# EAGLE design routev7.5 (EAGLE 8.6.0)

## Sheet 1 of 2
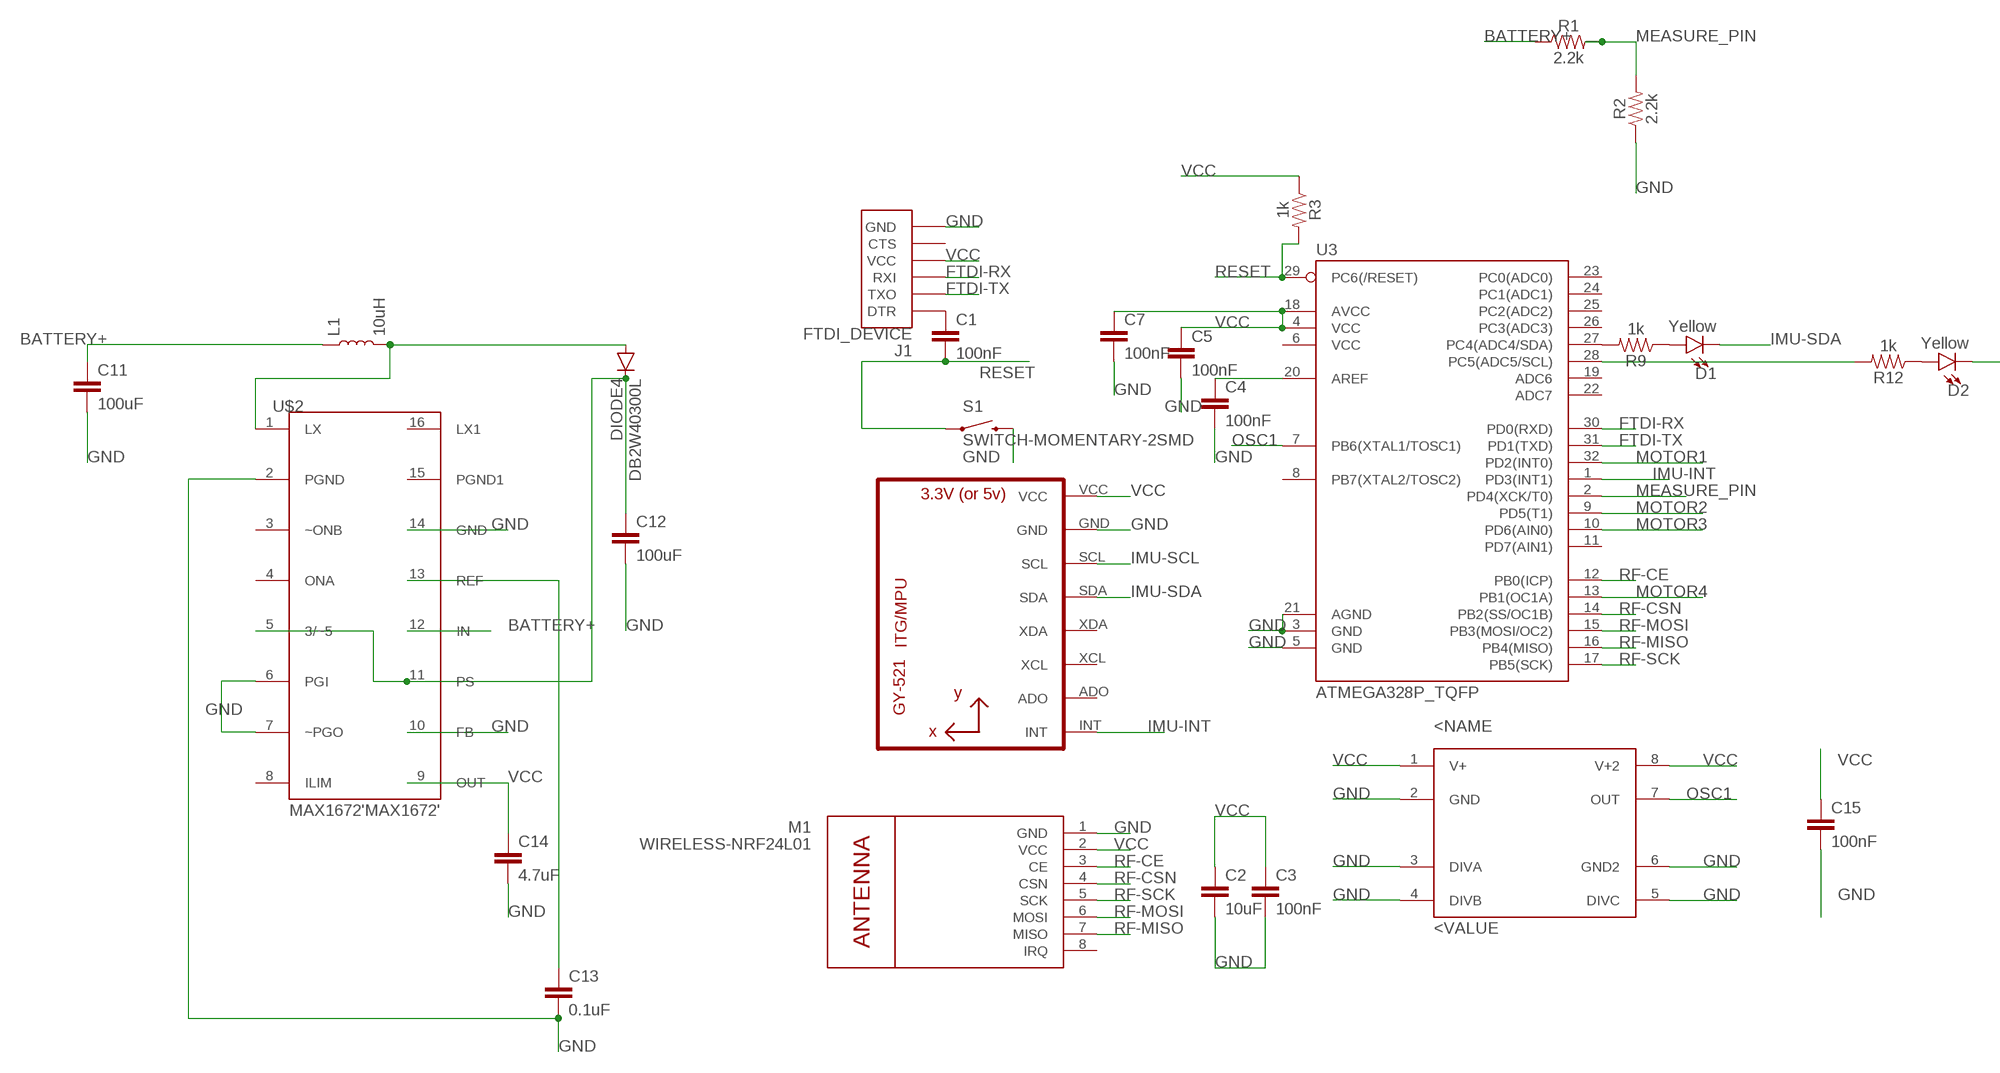
[diagram p0: schematic, sheet 1, part 1 of 2]
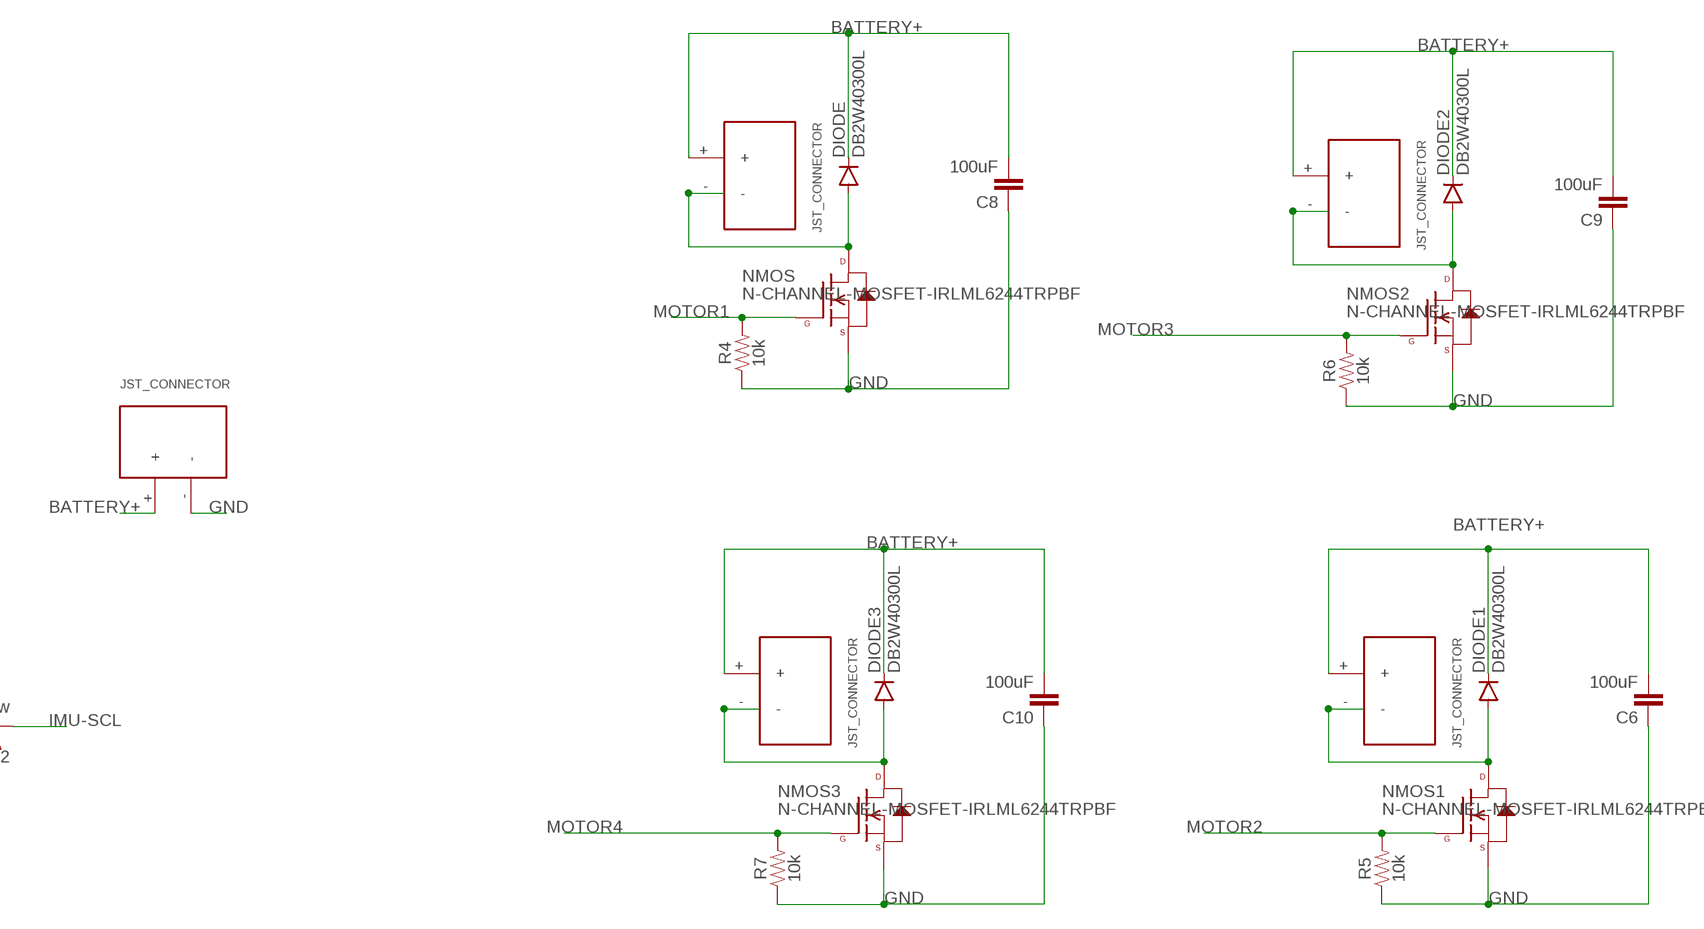
[diagram p1: schematic, sheet 1, part 2 of 2]

### Parts
C1  100nF  CAP0603-CAP  [0603-CAP]
C2  10uF  CAP0603-CAP  [0603-CAP]
C3  100nF  CAP0603-CAP  [0603-CAP]
C4  100nF  CAP0603-CAP  [0603-CAP]
C5  100nF  CAP0603-CAP  [0603-CAP]
C6  100uF  CAP0603-CAP  [0603-CAP]
C7  100nF  CAP0603-CAP  [0603-CAP]
C8  100uF  CAP0603-CAP  [0603-CAP]
C9  100uF  CAP0603-CAP  [0603-CAP]
C10  100uF  CAP0603-CAP  [0603-CAP]
C11  100uF  CAP0603-CAP  [0603-CAP]
C12  100uF  CAP0603-CAP  [0603-CAP]
C13  0.1uF  CAP0603-CAP  [0603-CAP]
C14  4.7uF  CAP0603-CAP  [0603-CAP]
C15  100nF  0.1UF-25V(+80/-20%)(0603)  [0603-CAP]
D1  Yellow  LED-YELLOWLILYPAD  [LED-1206]
D2  Yellow  LED-YELLOWLILYPAD  [LED-1206]
DIODE  DB2W40300L  [MINI2-F3-B]
DIODE1  DB2W40300L  [MINI2-F3-B]
DIODE2  DB2W40300L  [MINI2-F3-B]
DIODE3  DB2W40300L  [MINI2-F3-B]
DIODE4  DB2W40300L  [MINI2-F3-B]
J1  FTDI_DEVICE  [FTDI_DEVICE_SIDE]
L1  10uH  INDUCTOR-0603-33NH  [0603]
M1  WIRELESS-NRF24L01  [WIRELESS-NRF24L01]
MOTOR  JST_CONNECTOR_FEMALE  [JST_CONNECTOR_FEMALE]
MOTOR1  JST_CONNECTOR_FEMALE  [JST_CONNECTOR_FEMALE]
MOTOR2  JST_CONNECTOR_FEMALE  [JST_CONNECTOR_FEMALE]
MOTOR3  JST_CONNECTOR_FEMALE  [JST_CONNECTOR_FEMALE]
NMOS  N-CHANNEL-MOSFET-IRLML6244TRPBF  [SOT23-3]
NMOS1  N-CHANNEL-MOSFET-IRLML6244TRPBF  [SOT23-3]
NMOS2  N-CHANNEL-MOSFET-IRLML6244TRPBF  [SOT23-3]
NMOS3  N-CHANNEL-MOSFET-IRLML6244TRPBF  [SOT23-3]
R1  2.2k  2.2KOHM-0603-1/10W-1%  [0603]
R2  2.2k  2.2KOHM-0603-1/10W-1%  [0603]
R3  1k  2.2KOHM-0603-1/10W-1%  [0603]
R4  10k  2.2KOHM-0603-1/10W-1%  [0603]
R5  10k  2.2KOHM-0603-1/10W-1%  [0603]
R6  10k  2.2KOHM-0603-1/10W-1%  [0603]
R7  10k  2.2KOHM-0603-1/10W-1%  [0603]
R9  1k  2.2KOHM-0603-1/10W-1%  [0603]
R12  1k  2.2KOHM-0603-1/10W-1%  [0603]
S1  SWITCH-MOMENTARY-2SMD  [TACTILE-SWITCH-SMD]
U2  GY-521MPU6050  [GY-521]
U3  ATMEGA328P_TQFP  [TQFP32-08]
U$1  JST_CONNECTOR_FEMALE  [JST_CONNECTOR_FEMALE]
U$2  MAX1672'MAX1672'  [21-0055H_16]
U$3  LTC6930CMS8-8.19LTC6930CMS8-8.19  [SOP65P490X110-8N]

### Nets
BATTERY+: C6.2 C8.2 C9.2 C10.2 C11.1 DIODE1.NEG(GPIN) DIODE2.NEG(GPIN) DIODE3.NEG(GPIN) DIODE.NEG(GPIN) L1.1 MOTOR1.+ MOTOR2.+ MOTOR3.+ MOTOR.+ R1.1 U$1.+ U$2.12(IN)
FTDI-RX: J1.P$3(RXI) U3.30(PD0(RXD))
FTDI-TX: J1.P$2(TXO) U3.31(PD1(TXD))
GND: C2.2 C3.2 C4.2 C5.2 C6.1 C7.2 C8.1 C9.1 C10.1 C11.2 C12.2 C13.2 C14.2 C15.2 J1.P$6(GND) M1.1(GND) NMOS1.2(S) NMOS2.2(S) NMOS3.2(S) NMOS.2(S) R2.1 R4.1 R5.1 R6.1 R7.1 S1.3 U2.GND U3.3(GND) U3.5(GND) U3.21(AGND) U$1.- U$2.2(PGND) U$2.6(PGI) U$2.7(~PGO) U$2.10(FB) U$2.14(GND) U$3.2(GND) U$3.3(DIVA) U$3.4(DIVB) U$3.5(DIVC) U$3.6(GND2)
IMU-INT: U2.INT U3.1(PD3(INT1))
IMU-SCL: D2.C U2.SCL
IMU-SDA: D1.C U2.SDA
MEASURE_PIN: R1.2 R2.2 U3.2(PD4(XCK/T0))
MOTOR1: NMOS.1(G) R4.2 U3.32(PD2(INT0))
MOTOR2: NMOS1.1(G) R5.2 U3.9(PD5(T1))
MOTOR3: NMOS2.1(G) R6.2 U3.10(PD6(AIN0))
MOTOR4: NMOS3.1(G) R7.2 U3.13(PB1(OC1A))
N$1: DIODE4.POS(PPIN) L1.2 U$2.1(LX)
N$2: C4.1 U3.20(AREF)
N$3: D1.A R9.1
N$4: DIODE1.POS(PPIN) MOTOR1.- NMOS1.3(D)
N$5: DIODE2.POS(PPIN) MOTOR2.- NMOS2.3(D)
N$6: DIODE.POS(PPIN) MOTOR.- NMOS.3(D)
N$7: DIODE3.POS(PPIN) MOTOR3.- NMOS3.3(D)
N$8: R9.2 U3.27(PC4(ADC4/SDA))
N$9: D2.A R12.1
N$10: R12.2 U3.28(PC5(ADC5/SCL))
N$13: C1.1 J1.P$1(DTR)
OSC1: U3.7(PB6(XTAL1/TOSC1)) U$3.7(OUT)
RESET: C1.2 R3.2 S1.1 U3.29(PC6(/RESET))
RF-CE: M1.3(CE) U3.12(PB0(ICP))
RF-CSN: M1.4(CSN) U3.14(PB2(SS/OC1B))
RF-MISO: M1.7(MISO) U3.16(PB4(MISO))
RF-MOSI: M1.6(MOSI) U3.15(PB3(MOSI/OC2))
RF-SCK: M1.5(SCK) U3.17(PB5(SCK))
VCC: C2.1 C3.1 C5.1 C7.1 C14.1 C15.1 J1.P$4(VCC) M1.2(VCC) R3.1 U2.VCC U3.4(VCC) U3.18(AVCC) U$2.9(OUT) U$3.1(V+) U$3.8(V+2)
VR-PS: C12.1 DIODE4.NEG(GPIN) U$2.5(3/~5) U$2.11(PS)
VR-REF: C13.1 U$2.13(REF)
Unconnected: J1.P$5(CTS) M1.8(IRQ) U2.ADO U2.XCL U2.XDA U3.6(VCC) U3.8(PB7(XTAL2/TOSC2)) U3.11(PD7(AIN1)) U3.19(ADC6) U3.22(ADC7) U3.23(PC0(ADC0)) U3.24(PC1(ADC1)) U3.25(PC2(ADC2)) U3.26(PC3(ADC3)) U$2.3(~ONB) U$2.4(ONA) U$2.8(ILIM) U$2.15(PGND1) U$2.16(LX1)

## Sheet 2 of 2

## Library data of the parts
C1-C14 = SparkFun-Passives:CAP: Capacitor Standard 0603 ceramic capacitor, and 0.1" leaded capacitor.
C15 = SparkFun-Capacitors:0.1UF-25V(+80/-20%)(0603): CAP-00810 Ceramic Standard decoupling cap; PROD_ID: CAP-00810; VALUE: 0.1uF
D1 D2 = SparkFun-LED:LED-YELLOW: Yellow SMD LED Used in manufacturing several products at SparkFun. Packages: 0603 - SMD 0603 package[Product Link] <http://www.kingbrightusa.com/product.asp?catalog_name=LED&product_id=APT1608SYCK> 0603 -SMART - SMART SMD 0603 package (more efficient/more expensive) [Product Link] <http://www.osram-os.com/osram_os/en/products/product-catalog/led-light-emitting-diodes/smartled-0603/ly-l29k/index.jsp> LilyPad - SMD1206 package[Product Datasheet] <https://www.sparkfun.com/datasheets/DevTools/LilyPad/Q150YUS4.pdf> SparkFun Products: Blynk Board <https://www.sparkfun.com/products/13794> IOIO-OTG <https://www.sparkfun.com/products/13613> XBee Explorer Serial <https://www.sparkfun.com/products/13225>; PROD_ID: DIO-09909
DIODE DIODE1-DIODE4 = quad:DB2W40300L
J1 = quad:FTDI_DEVICE: Connector which mates to FTDI basic or FTDI cable.
L1 = SparkFun-Coils:INDUCTOR: Inductors Resist changes in electrical current. Basically a coil of wire. SparkFun Products: SparkFun Load Cell Amplifier - HX711 <https://www.sparkfun.com/products/13879> IOIO-OTG - V2.2 <https://www.sparkfun.com/products/13613>; PROD_ID: NDUC-07874; VALUE: 33nH/±5%/500mA
M1 = quad:WIRELESS-NRF24L01: 2.4 GHz Wireless Module based on NRF24L01 chip
MOTOR MOTOR1-MOTOR3 U$1 = quad:JST_CONNECTOR_FEMALE
NMOS NMOS1-NMOS3 = quad:N-CHANNEL-MOSFET: N-Channel MOSFET Mode Field Effect Transistor; DATASHEET: http://www.mouser.com/ds/2/196/irlml6244pbf-936666.pdf; MOUSER: 942-IRLML6244TRPBF; URL: http://www.mouser.com/Search/ProductDetail.aspx?R=IRLML6244TRPBFvirtualkey57370000virtualkey942-IRLML6244TRPBF
R1 R2 = SparkFun-Resistors:2.2KOHM: 2.2kΩ resistor A resistor is a passive two-terminal electrical component that implements electrical resistance as a circuit element. Resistors act to reduce current flow, and, at the same time, act to lower voltage levels within circuits. - Wikipedia; PROD_ID: RES-08272
R3-R7 R9 R12 = SparkFun-Resistors:2.2KOHM: 2.2kΩ resistor A resistor is a passive two-terminal electrical component that implements electrical resistance as a circuit element. Resistors act to reduce current flow, and, at the same time, act to lower voltage levels within circuits. - Wikipedia; PROD_ID: RES-08272; VALUE: 2.2k
S1 = quad:SWITCH-MOMENTARY-2: Various NO switches- pushbuttons, reed, etc; PROD_ID: SWCH-08247
U2 = quad:GY-521
U3 = quad:ATMEGA328P_TQFP; PROD_ID: IC-09069
U$2 = voltreg:MAX1672
U$3 = LTC6390:LTC6930CMS8-8.19

## Board
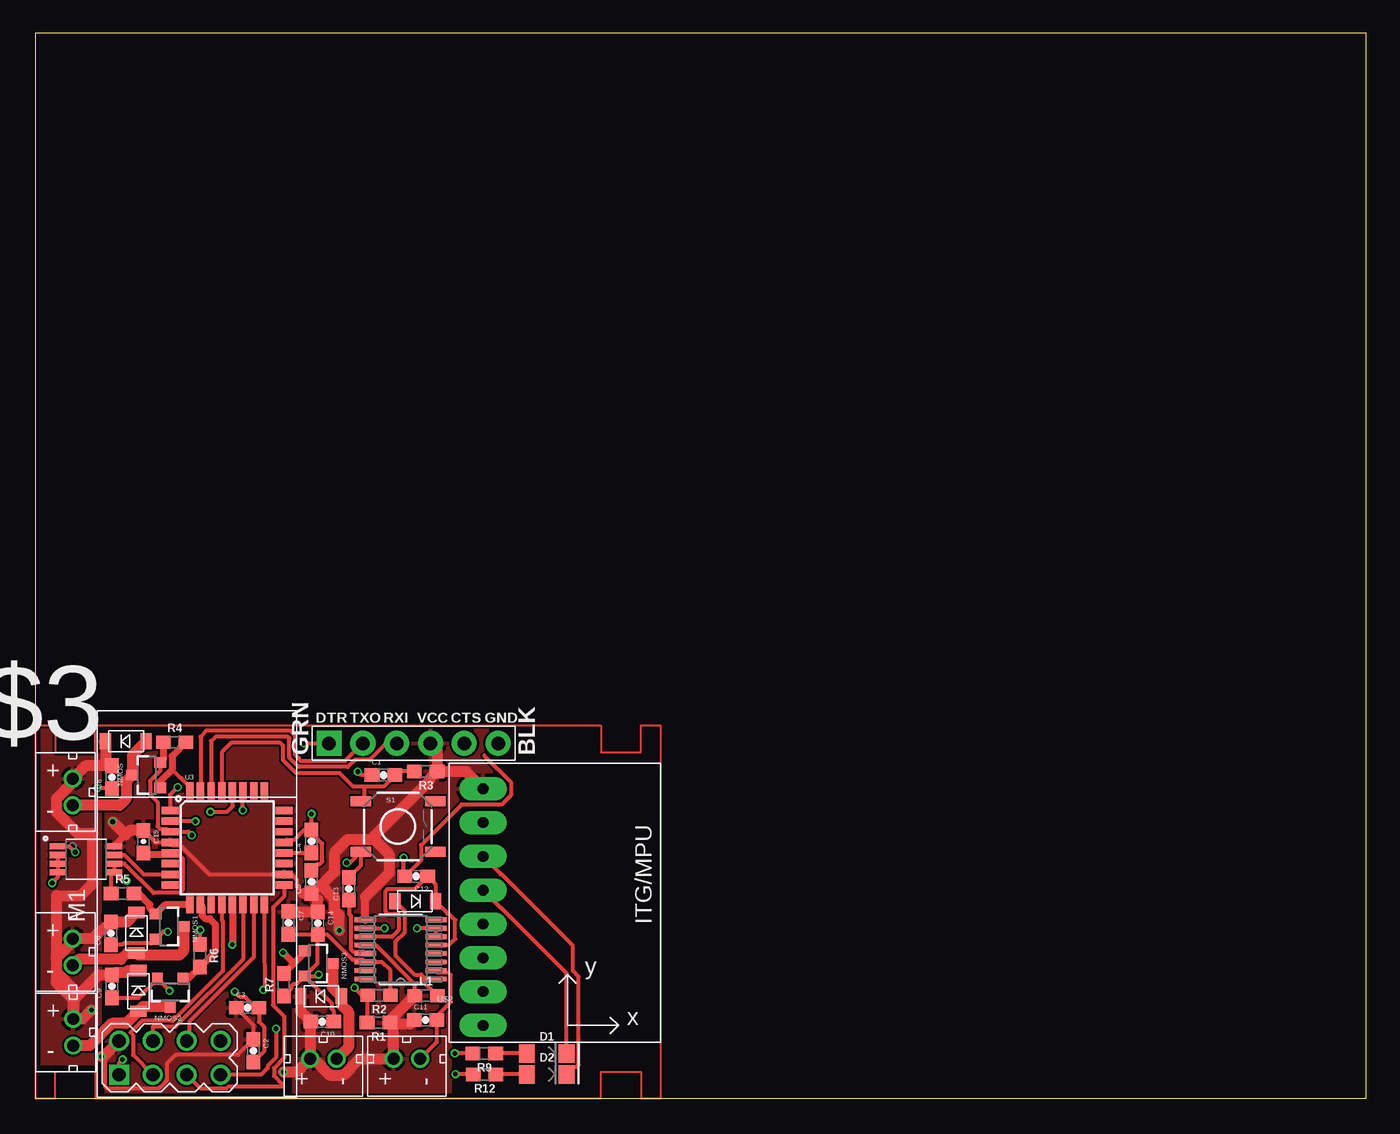
[diagram p2: board, top side]
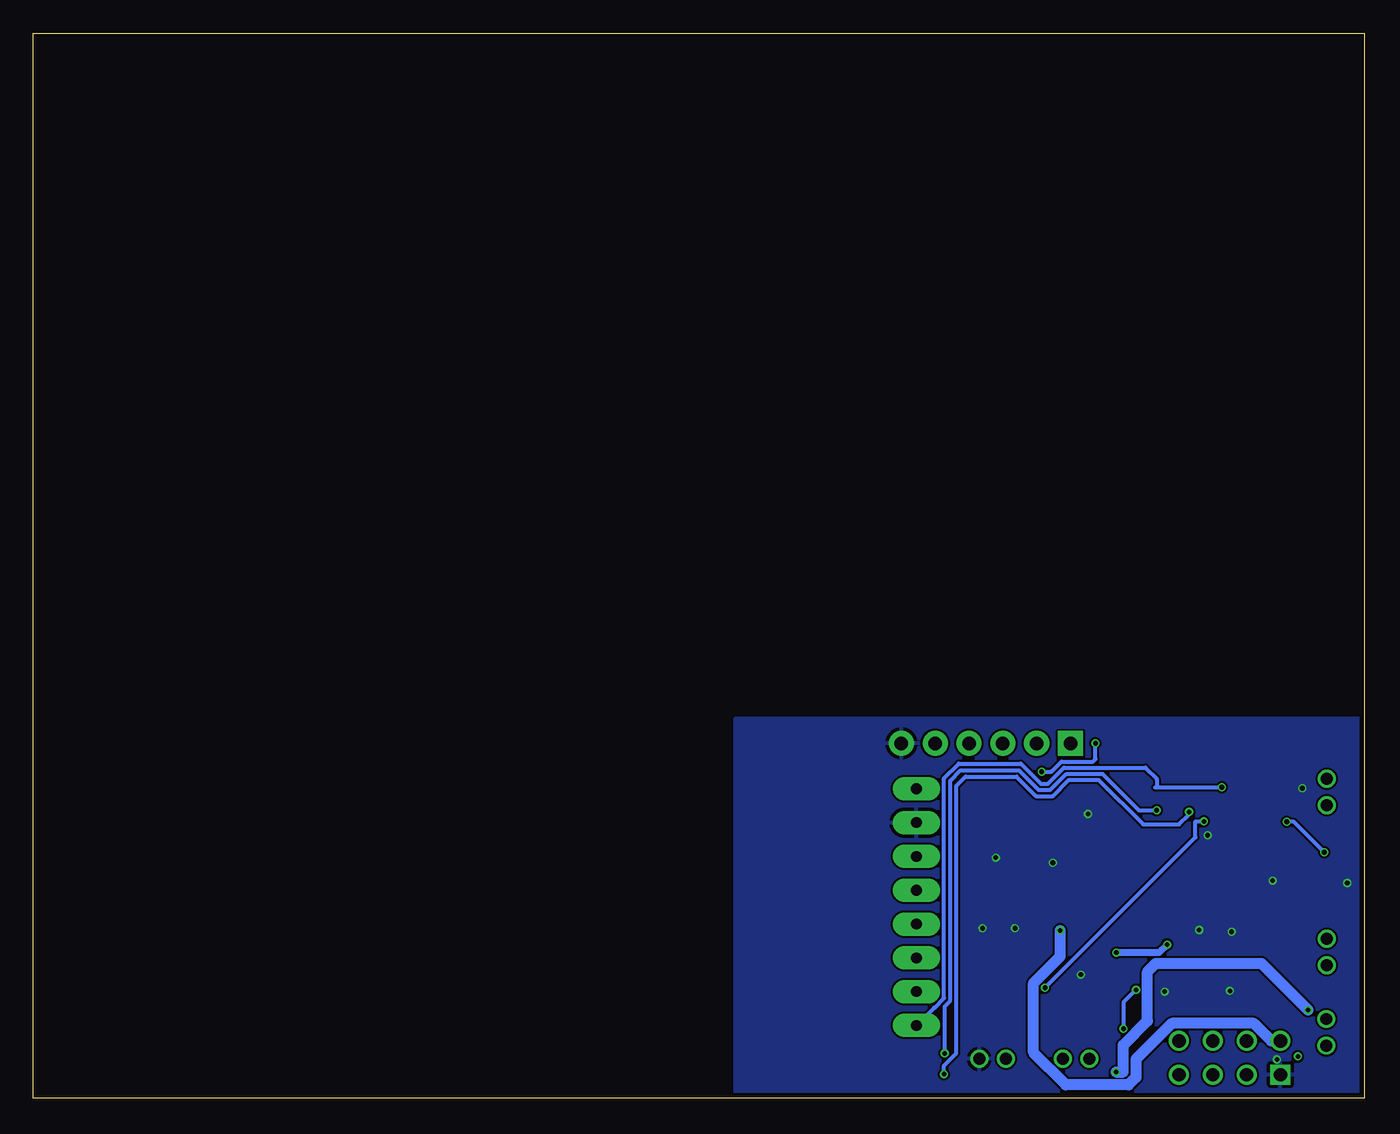
[diagram p3: board, bottom side, seen from below]

Size 100 x 80 mm. Coordinates in mm from the lower left corner, seen from the top.
Outline: 0,0 100,0 100,80 0,80 0,0
Copper layers (1*16): Top 0.035559375mm / dielectric 1.6mm / Bottom 0.035559375mm
Design rules "oshpark-2layer": minimum track width 6mil, minimum drill 10mil, track to track 6mil, track to pad 6mil, pad to pad 6mil, via to via 6mil, smd to smd 6mil, copper to edge 15mil, drill to drill 6mil, minimum pad ring 5mil, minimum via ring 5mil, stop-mask expansion 2.5mil, vias tented up to drill 0mil, thermal gap 10mil

### Footprints (pad centres in the part's own frame; a part is rotated, then mirrored left to right if it is on the bottom)
0603-CAP = smd 1.1 x 1: 1 -0.85,0; 2 0.85,0
LED-1206 = smd 1.2 x 1.4: A -1.5,0; C 1.5,0
MINI2-F3-B = smd 1.22 x 0.85: NEG 0,1.55; POS 0,-1.5
FTDI_DEVICE_SIDE = drill 1.016 pad 1.88 square: P$1 -6.35,0 | drill 1.016 pad 1.88: P$2 -3.81,0; P$3 -1.27,0; P$4 1.27,0; P$5 3.81,0; P$6 6.35,0
0603 = smd 1.1 x 1: 1 -0.85,0; 2 0.85,0
WIRELESS-NRF24L01 = drill 1 square: 1 -12.7,6.35 | drill 1: 2 -10.16,6.35; 3 -12.7,3.81; 4 -10.16,3.81; 5 -12.7,1.27; 6 -10.16,1.27; 7 -12.7,-1.27; 8 -10.16,-1.27
JST_CONNECTOR_FEMALE = drill 0.889: + 0,1; - 0,-1
SOT23-3 = smd 0.8 x 0.9: 1 -0.95,-1; 2 0.95,-1; 3 0,1.1
TACTILE-SWITCH-SMD = smd 1.524 x 0.762: 1 -2.794,1.905; 2 2.794,1.905; 3 -2.794,-1.905; 4 2.794,-1.905
GY-521 = drill 0.8 pad 1.778 long: ADO -8.89,-6.35; GND -8.89,6.35; INT -8.89,-8.89; SCL -8.89,3.81; SDA -8.89,1.27; VCC -8.89,8.89; XCL -8.89,-3.81; XDA -8.89,-1.27
TQFP32-08 = smd 1.27 x 0.559: 1 -4.293,2.8; 2 -4.293,2; 3 -4.293,1.2; 4 -4.293,0.4; 5 -4.293,-0.4; 6 -4.293,-1.2; 7 -4.293,-2; 8 -4.293,-2.8; 17 4.293,-2.8; 18 4.293,-2; 19 4.293,-1.2; 20 4.293,-0.4; 21 4.293,0.4; 22 4.293,1.2; 23 4.293,2; 24 4.293,2.8 | smd 0.559 x 1.27: 9 -2.8,-4.293; 10 -2,-4.293; 11 -1.2,-4.293; 12 -0.4,-4.293; 13 0.4,-4.293; 14 1.2,-4.293; 15 2,-4.293; 16 2.8,-4.293; 25 2.8,4.293; 26 2,4.293; 27 1.2,4.293; 28 0.4,4.293; 29 -0.4,4.293; 30 -1.2,4.293; 31 -2,4.293; 32 -2.8,4.293
21-0055H_16 = smd 1.6 x 0.356: 1 -2.654,2.223; 2 -2.654,1.587; 3 -2.654,0.953; 4 -2.654,0.318; 5 -2.654,-0.318; 6 -2.654,-0.953; 7 -2.654,-1.587; 8 -2.654,-2.223; 9 2.654,-2.223; 10 2.654,-1.587; 11 2.654,-0.953; 12 2.654,-0.318; 13 2.654,0.318; 14 2.654,0.953; 15 2.654,1.587; 16 2.654,2.223
SOP65P490X110-8N = smd 1.25 x 0.46: 1 -2.11,0.975; 2 -2.11,0.325; 3 -2.11,-0.325; 4 -2.11,-0.975; 5 2.11,-0.975; 6 2.11,-0.325; 7 2.11,0.325; 8 2.11,0.975

### Placement (x,y rotation side)
C1  26.16,24.28 0 top
C2  16.38,3.58 270 top
C3  15.95,6.81 0 top
C4  20.75,19.3 90 top
C5  20.75,16.26 90 top
C6  5.69,12.4 90 top
C7  19.02,13.18 270 top
C8  5.77,24.13 90 top
C9  5.77,8.41 90 top
C10  21.56,5.77 180 top
C11  29.33,5.89 0 top
C12  28.62,16.68 180 top
C13  23.57,15.74 90 top
C14  21.23,13.15 270 top
C15  8.13,19.28 270 top
D1  38.43,3.38 0 top
D2  38.43,1.8 0 top
DIODE  6.83,26.82 90 top
DIODE1  7.59,12.42 0 top
DIODE2  7.75,8.05 0 top
DIODE3  21.49,7.67 90 top
DIODE4  28.52,14.8 270 top
J1  28.42,26.67 0 top
L1  29.36,7.72 0 top
M1  12.65,14.48 90 top
MOTOR  2.82,23.01 0 top
MOTOR1  2.82,11 0 top
MOTOR2  2.84,4.97 0 top
MOTOR3  21.64,2.97 90 top
NMOS  8.38,24.28 90 top
NMOS1  10.03,12.9 270 top
NMOS2  10.13,8 180 top
NMOS3  21.23,10.13 270 top
R1  25.78,5.69 180 top
R2  25.83,7.75 180 top
R3  29.34,24.56 180 top
R4  10.46,26.75 0 top
R5  6.55,15.39 0 top
R6  12.37,10.72 270 top
R7  18.67,8.53 90 top
R9  33.73,3.38 180 top
R12  33.76,1.8 180 top
S1  27.25,20.42 0 top
U2  42.54,14.37 0 top
U3  14.41,18.83 0 top
U$1  27.91,2.97 90 top
U$2  27.45,11.2 180 top
U$3  3.81,17.96 0 top

### Tracks (layer width: path | path; a pad name or v marks a point on that pad's centre or on a via)
BATTERY+  (via drill 0.35)
  Top 0.305: U$2.12 24.82,11.49 25.6,11.49 28.51,8.58 L1.1
  Top 0.813: DIODE1.NEG 6.87,13.24 C6.2 5.1,12.65 4.96,12.65 4.3,12 MOTOR1.+ 2.82,11.78 1.56,10.52 1.56,8.72 2.87,7.42 | DIODE2.NEG 6.95,9.6 6.82,9.47 5.98,9.47 C9.2 4.71,9.26 2.87,7.42 | 2.87,7.42 2.87,5.99 MOTOR2.+ | DIODE.NEG 5.28,25.46 C8.2 3.79,24.98 MOTOR.+ 2.82,23.75 1.59,22.52 1.59,21.5 3.24,19.86 4.32,19.86 4.32,16.13 3.42,15.23 1.59,15.23 1.59,9.49 2.84,8.24 MOTOR2.+ | DIODE3.NEG 19.94,6.54 C10.2 20.64,5.69 MOTOR3.+ | L1.1 26.63,5.84 | 26.63,5.84 R1.1 | 26.91,5.55 U$1.+ 24.37,2.97 23.15,1.75 22.13,1.75 20.91,2.97 MOTOR3.+ | 26.91,5.55 26.63,5.84 | MOTOR3.+ 19.65,1.98 v18.64,1.98 | C11.1 28.15,5.55 26.91,5.55 | v4.22,6.63 3.55,5.97 MOTOR2.+
  Bottom 0.813: v18.64,1.98 18.11,1.98 18.11,3.99 16.28,5.82 16.28,9.53 15.67,10.13 7.72,10.13 v4.22,6.63
  pour Top: 0,28.04 4.85,28.02 4.85,2.57 0,2.59
  pour Top: 19.46,8.53 31.14,8.53 31.14,0.05 19.46,0.05
FTDI-RX
  Top 0.305: U3.30 13.21,26.84 13.54,27.16 18.98,27.16 19.07,27.07 19.07,25.59 19.78,24.89 23.48,24.89 24.04,25.45 24.07,25.45 24.1,25.43 25.13,25.43 26.37,26.67 J1.P$3
FTDI-TX
  Top 0.305: U3.31 12.41,27.18 12.85,27.62 19.17,27.62 19.53,27.25 19.53,25.81 19.79,25.55 19.79,25.53 19.96,25.35 23.29,25.35 J1.P$2
GND  (via drill 0.35)
  Top 0.305: U$3.2 U$3.3 U$3.4 1.7,16.61 v1.27,16.18 | U$3.5 U$3.6 6.69,17.63 8.88,15.45 10.88,15.45 11.06,15.62 11.06,18.03 10.88,18.21 8.34,18.21 C15.2 | C9.1 7.74,7.56 NMOS2.2 10.08,8.1 v10.08,8.08 | C6.1 6.52,11.54 6.63,11.65 8.73,11.65 NMOS1.2 9.6,12.52 v9.96,12.52 | R5.1 5.7,16.77 U$3.5 | C13.2 24.46,17.49 S1.3 23.65,17.7 v23.39,17.7 | U3.21 18.92,19.45 19.47,19.45 20.18,20.15 C4.2 | C7.2 21.2,12.33 | 21.2,12.33 C14.2 21.95,12.3 23.86,10.4 24.65,10.4 U$2.14 26.05,10.24 26.68,9.62 R2.1 | NMOS3.2 21.2,10.15 21.2,12.33 | NMOS3.2 22.26,7.16 22.26,6.76 22.41,6.6 C10.1 | C2.2 17.19,3.54 17.19,5.37 16.8,5.75 C3.2 16.58,6.81 15.78,7.61 15.4,7.61 v14.99,8.03 | U$1.- 30.18,4.24 C11.2 30.18,6.21 31.21,7.24 31.21,9.28 31.03,9.46 30.26,9.46 U$2.2 | 33.73,25.75 35.73,23.75 35.73,22.76 35.03,22.07 32.02,22.07 28.98,19.02 28.98,17.89 C12.2 27.69,16.77 v27.69,18.09 | NMOS.2 9.38,24.61 8.63,23.86 8.63,22.81 9.18,22.25 9.18,20.42 9.36,20.25 9.9,20.25 U3.3 11.49,20.03 v11.76,19.76 | C8.1 v4.66,23.28 v4.65,23.29 | U3.5 C15.2 | C15.2 | M1.1 6.3,2.66 v6.55,2.92 | U$3.5 6.54,16.36 v6.88,16.36 | R6.1 12.39,11.59 v12.39,12.65 | NMOS3.2 19.64,8.59 19.39,8.59 19.21,8.41 19.21,8.22 R7.1 | U$2.10 v26.23,12.78 v26.24,12.78 | C5.2 21.25,17.6 21.38,17.6 21.56,17.78 21.56,19.13 20.75,19.93 C4.2 | C4.2 v20.75,21.36 | NMOS3.2 21.17,9.19 v21.29,9.3 | U$2.6 U$2.7 v28.68,12.78
  Top 0.508: R4.1 9.62,25.46 NMOS.2
  pour Bottom: -0.15,28.5 47.27,28.5 47.27,-0.41 -0.56,-0.41 -0.56,28.5
IMU-INT  (via drill 0.35)
  Top 0.305: v10.69,23.37 10.14,22.81 10.12,22.79 U3.1
  Bottom 0.305: U2.INT 32.3,6.83 32.27,6.83 31.57,7.52 31.57,24.04 30.45,25.15 25.8,25.15 24.28,23.62 23.78,23.62 22.56,24.84 16.43,24.84 15.6,24 15.6,23.39 15.57,23.37 | 15.72,23.37 15.57,23.37 | 15.57,23.37 v10.69,23.37
IMU-SCL
  Top 0.305: U2.SCL 34.99,16.83 35.03,16.83 40.39,11.48 40.39,9.58 40.84,9.14 40.84,2.55 40.66,2.37 40.5,2.37 D2.C
IMU-SDA
  Top 0.305: U2.SDA 34.99,14.29 35.03,14.29 39.93,9.39 D1.C
MEASURE_PIN  (via drill 0.35)
  Top 0.305: v23.98,8.31 24.54,7.75 R2.2 24.93,7.7 R1.2 | v12.04,20.8 12.01,20.83 U3.2
  Bottom 0.305: v23.98,8.31 12.68,19.61 12.68,20.8 v12.04,20.8
MOTOR1
  Top 0.305: 10.28,24.7 10.93,24.05 10.98,24.05 11.61,23.41 U3.32
  Top 0.508: R4.2 10.28,25.71 10.28,24.7 9.38,23.81 NMOS.1
MOTOR2
  Top 0.508: U3.9 9.72,14.54 NMOS1.1 8.61,14.28 8.61,14.56 7.78,15.39 R5.2
MOTOR3
  Top 0.508: U3.10 12.53,14.42 12.53,13.73 12.77,13.49 13.11,13.49 13.53,13.07 13.53,11.03 R6.2 11.5,9 NMOS2.1
MOTOR4  (via drill 0.35)
  Top 0.508: R7.2 19.4,10.12 | 19.4,10.12 20.23,10.95 NMOS3.1 | U3.13 v14.81,11.56 | v18.62,10.95 19.4,10.17 19.4,10.12
  Bottom 0.508: v14.81,11.56 15.42,10.95 v18.62,10.95
N$1
  Top 0.305: 29,9.3 29.33,8.97 U$2.1 | 29,9.3 29,8.92 L1.2 | DIODE4.POS 27.75,14.08 27.75,12.44 27.05,11.75 27.05,10.74 28.49,9.3 29,9.3
N$2
  Top 0.305: C4.1 20.73,18.43 U3.20
N$3
  Top 0.305: D1.A R9.1
N$4
  Top 0.813: NMOS1.3 11.13,11.08 10.82,10.77 7.75,10.77 DIODE1.POS 6.91,10.92 6.42,10.44 3.26,10.44 MOTOR1.-
N$5
  Top 0.813: NMOS2.3 8.1,6.9 DIODE2.POS 6.83,5.63 5.75,5.63 4.08,3.97 MOTOR2.-
N$6
  Top 0.813: DIODE.POS 7.28,25.77 NMOS.3 6.83,23.82 6.83,22.5 6.34,22.01 MOTOR.-
N$7
  Top 0.813: NMOS3.3 22.33,8.32 DIODE3.POS 22.99,7.03 23.52,6.5 23.52,3.85 MOTOR3.-
N$8  (via drill 0.35)
  Top 0.305: R9.2 v31.52,3.38 | v15.6,21.64 15.6,23.1 U3.27
  Bottom 0.305: v31.52,3.38 31.52,6.92 31.11,7.33 31.11,23.85 30.32,24.63 25.93,24.63 24.47,23.17 23.59,23.17 22.37,24.38 19.66,24.38 16.92,21.64 v15.6,21.64
N$9
  Top 0.305: D2.A R12.1
N$10  (via drill 0.35)
  Top 0.305: R12.2 32.88,1.83 v31.57,1.83 | v13.16,21.51 14.4,21.51 14.83,21.95 14.81,21.97 U3.28
  Bottom 0.305: v31.57,1.83 31.57,2.47 30.65,3.39 30.65,23.47 29.95,24.18 26.12,24.18 24.66,22.71 23.4,22.71 22.18,23.93 19.96,23.93 16.61,20.57 13.92,20.57 13.16,21.34 v13.16,21.51
N$11
  Top 0.152: 1.5,2 1.5,0 0,0 0,28 1.5,28 1.5,26 4.5,26 4.5,28 42.5,28 42.5,26 45.5,26 45.5,28 47,28 47,0 45.5,0 45.5,2 42.5,2 42.5,0 4.5,0 4.5,2
N$13  (via drill 0.35)
  Top 0.305: C1.1 24.49,24.28 v24.23,24.54 | v20.19,26.67 J1.P$1
  Bottom 0.305: v24.23,24.54 23.51,24.54 22.75,25.3 20.37,25.3 20.19,25.48 v20.19,26.67
OSC1
  Top 0.305: U$3.7 6.68,18.28 8.14,16.83 U3.7
RESET
  Top 0.305: 24.74,23.43 23.87,23.43 22.86,24.43 19.59,24.43 18.62,25.4 18.62,26.49 18.41,26.7 14.73,26.7 14.01,25.99 U3.29 | S1.1 24.74,22.61 24.74,23.43 | R3.2 27.29,24.56 C1.2 26.16,23.43 24.74,23.43
RF-CE
  Top 0.305: U3.12 14.01,13.38 14.09,13.31 14.09,9.57 10.34,5.82 8.02,5.82 7.16,4.96 7.36,4.76 7.36,3.26 M1.3
RF-CSN
  Top 0.305: U3.14 15.61,10.45 10.53,5.37 8.84,5.37 M1.4
RF-MISO  (via drill 0.35)
  Top 0.305: U3.16 17.21,12.13 17.22,8.15 v17.14,8.15 | v18.09,5.23 18.09,3.08 17.48,2.46 17.48,2.29 16.97,1.78 M1.7
  Bottom 0.305: v17.14,8.15 18.09,7.21 v18.09,5.23
RF-MOSI
  Top 0.305: U3.15 16.41,10.61 11.58,5.77 11.58,4.52 M1.6
RF-SCK
  Top 0.305: U3.17 18.71,15.2 17.86,14.35 17.86,7.01 18.71,6.17 18.71,3.05 17.93,2.28 17.93,1.69 18.52,1.1 18.52,0.89 14.52,0.89 14.35,0.73 12.43,0.73 M1.5
VCC  (via drill 0.35)
  Top 0.305: C15.1 9.03,19.23 U3.4 10.34,19.01 10.88,19.01 13.07,16.83 U3.18 19.25,16.83 19.65,16.43 19.65,15.89 20.13,15.41 | C3.1 16.38,5.53 C2.1 15.22,3.27 10.56,3.27 9.89,2.59 9.89,1.34 9.27,0.73 5.42,0.73 5.24,0.9 5.24,3.03 5.12,3.15 | U$3.1 2.56,18.93 v3,18.49
  Top 0.508: U$3.8 6.78,19.79
  Top 0.61: U$2.9 24.8,15.12
  Top 0.813: U2.VCC 32.37,24.54 30.21,24.54 R3.1 | C7.1 19.06,14 C14.1 21.23,14.93 C5.1 | 24.8,15.12 26.62,16.94 26.62,18.29 25.45,19.46 | C15.1 7.12,20.13 6.78,19.79 6.78,19.82 v5.82,20.78 | M1.2 5.12,3.15 v4.98,3.15 | C5.1 21.34,16 21.48,16 | 25.45,19.46 23.47,19.46 22.51,18.5 22.51,17.02 21.48,16 | 20.13,15.41 C5.1 | v22.84,12.62 22.84,13.79 22.51,14.11 22.51,14.97 21.48,16 | R3.1 29.6,23.97 29.6,23.83 25.45,19.69 25.45,19.46 | J1.P$4 30.19,26.18 R3.1
  Bottom 0.305: v3,18.49 5.28,20.78 v5.82,20.78
  Bottom 0.813: M1.2 6.99,4.32 8.29,5.63 14.46,5.63 17.14,2.95 17.14,1.58 17.71,1.02 22.42,1.02 24.84,3.44 24.84,8.66 22.84,10.67 v22.84,12.62
  pour Top: 5.36,28.09 36.55,28.09 36.47,9.04 18.85,9.04 18.92,6.63 18.69,6.63 18.69,0 5.36,0
VR-PS
  Top 0.305: U$2.5 31.07,11.51 31.55,11.99 31.55,13.39 31.03,13.9 30.97,13.9 DIODE4.NEG 30.07,16.08 C12.1 28.51,15.72 26.47,15.72 26.29,15.54 26.29,14.07 26.47,13.89 27.29,13.89 27.29,12.63 26.8,12.14 26.79,12.15 U$2.11
VR-REF
  Top 0.305: U$2.13 24.65,11.03 23.87,11.03 23.69,11.21 23.69,13.72 23.57,13.85 C13.1